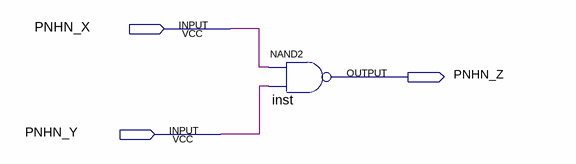
[diagram p0: schematic sheet]
// Quartus schematic Assignment3.bdf as structural Verilog: 1 symbols, 3 pins
module Assignment3 (
  input  PNHN_X,
  input  PNHN_Y,
  output PNHN_Z
);

  nand inst (PNHN_Z, PNHN_X, PNHN_Y);
endmodule
